# Altium schematic sheet FLASH.SchDoc
size A; SheetNumber: 4; SheetTotal: 4
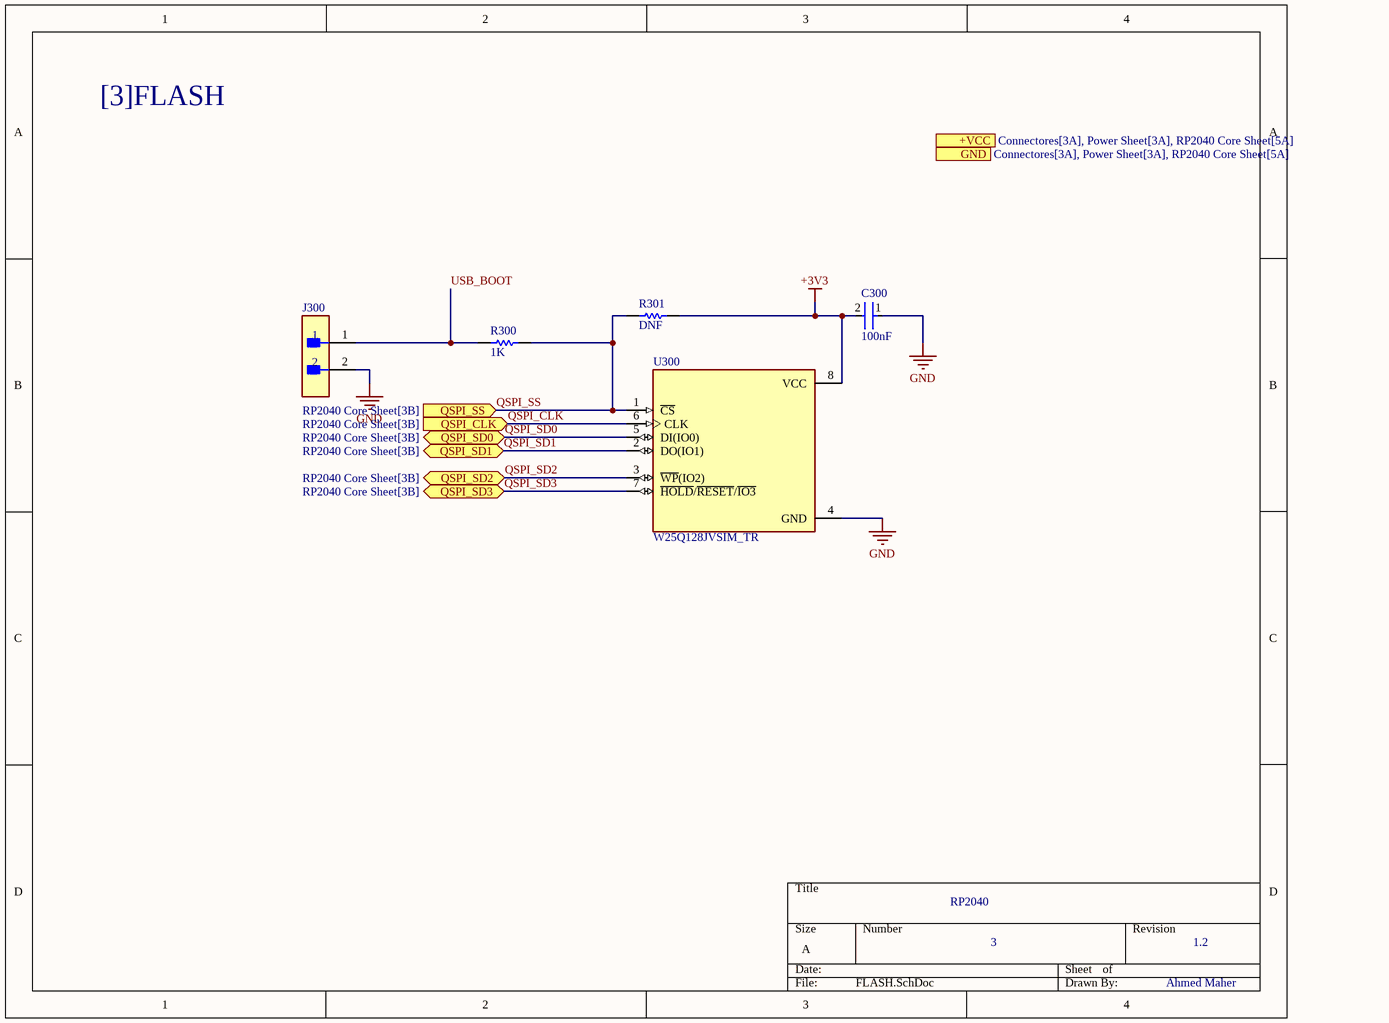
[diagram p0: FLASH.SchDoc]

## Parts
C300  100nF  [FP-CGA3E-0_3-0_1-IPC_A]
J300  M20-9990245  [FP-M20-9990245-MFG]  (value not drawn)
R300  1K  [RESC2013X60X35ML10T20]
R301  DNF  [RESC2013X60X35ML10T20]
U300  W25Q128JVSIM_TR  [SOIC127P790X216-8N]

## Ports
+VCC (see Connectores[3A], Power Sheet[3A], RP2040 Core Sheet[5A]), GND (see Connectores[3A], Power Sheet[3A], RP2040 Core Sheet[5A]), QSPI_CLK (in, see RP2040 Core Sheet[3B]), QSPI_SD0 (bidir, see RP2040 Core Sheet[3B]), QSPI_SD1 (bidir, see RP2040 Core Sheet[3B]), QSPI_SD2 (bidir, see RP2040 Core Sheet[3B]), QSPI_SD3 (bidir, see RP2040 Core Sheet[3B]), QSPI_SS (in, see RP2040 Core Sheet[3B])

## Nets
+3V3: C300.2 R301.2 U300.8(VCC)
GND: C300.1 J300.2 U300.4(GND)
QSPI_CLK: U300.6(CLK) ; port QSPI_CLK
QSPI_SD0: U300.5(DI(IO0)) ; port QSPI_SD0
QSPI_SD1: U300.2(DO(IO1)) ; port QSPI_SD1
QSPI_SD2: U300.3(~{WP}(IO2)) ; port QSPI_SD2
QSPI_SD3: U300.7(~{HOLD}/~{RESET}/~{IO3}) ; port QSPI_SD3
QSPI_SS: R300.2 R301.1 U300.1(~{CS}) ; port QSPI_SS
USB_BOOT: J300.1 R300.1

## Notes on the sheet
- [3]FLASH
- RP2040
- 3
- 1.2
- Ahmed Maher

## Library data of the parts
C300 = CMP-2000-07546-2: Cap Ceramic 100nF 50V X7R 10% Pad SMD 0603 +125°C Automotive T/R; Weight: 7.1E-05oz; Composition: Ceramic; Max Operating Temperature: 125°C; Termination: SMD/SMT; Dielectric: X7R; Length: 1.6mm; Package Quantity: 1; REACH SVHC: No SVHC; Lead Free: Lead Free; Case Code (Metric): 1608; Min Operating Temperature: -55°C; Packaging: Tape and Reel; Tolerance: 10%; Voltage Rating: 50V; Case Code (Imperial): 0603; Capacitance: 100nF; Case/Package: 0603; Voltage Rating (DC): 50V; Depth: 0.8mm; Radiation Hardening: No; Ratings: AEC-Q200; Mount: Surface Mount; Voltage: 50V; Thickness: 0.035inch; Width: 0.8mm; Height: 0.8mm
J300 = CMP-15831-000105-1: CONN HEADER VERT 2POS 2.54MM; Working Voltage: 750V; Gender: Male; Number of Poles: 2; Current Rating: 3A; Mated Stacking Heights: 16.54mm; Contact Resistance: 25mR; Connector Type: Male Pin; Insulation Resistance: 10GR; Mating Cycles: 300; Voltage: 50V; Flammability Rating: UL94 V-0; Pitch: 2.54mm; Series: M20; Number of Contacts: 2; Height: 0.12inch; Min Operating Temperature: -40°C; Contact Finish - Mating: GOLD; Number of Positions: 2; Number of Rows: 1; Packaging: Bulk; Package Quantity: 1000; Voltage Rating (AC): 750V; Current: 3A; Mount: Through Hole; Case/Package: SIL; Orientation: Straight; Contact Shape: Square; Weight: 0.25lb; Radiation Hardening: No; Fastening Type: Pull; Length: 5.08mm; Depth: 2.54mm; Contact Mating Length: 0.24inch; Housing Material: Nylon; Reach SVHC Compliant: Yes; Insulation Material: Nylon; Color: Black; Width: 0.25inch; Insulation Color: Black; Contact Material: Brass; Contact Type: Male Pin; Termination: Solder; Max Operating Temperature: 105°C; Contact Plating: Gold; Housing Color: Black; Max Current Rating: 3A; Lead Pitch: 2.54mm
R300 R301 = CMP-2100-03671-1: Chip Resistor, 1 KOhm, +/- 1%, 125 mW, -55 to 155 degC, 0805 (2012 Metric), RoHS, Tape and Reel; Manufacturer: Yageo; Temperature Coefficient: 100ppm/degreesC; Voltage Rating (DC): 150V; Max Power Dissipation: 125mW; Resistance: 1KOhm; Number of Pins: 2; Number of Terminations: 2; Datasheet URL: http://www.yageo.com/NewPortal/yageodocoutput?fileName=/pdf/R-Chip/PYu-RC_Group_51_RoHS_L_5.pdf; Length: 0.079inch; Package Description: 2-Pin Surface Mounted Device, Body 2 x 1.25 mm; Depth: 1.25mm; Height: 0.024inch; Military Standard: Not; Case/Package: 0805; Package Reference: 0805; RoHSCompliant: true; Lead Free: LeadFree; Packaging: TapeandReel; Package Quantity: 1; Datasheet Version: Rev. 5, 10/2016; Tolerance: 1%; Min Operating Temperature: -55degC; Voltage Rating: 150V; Composition: ThickFilm; Case Code (Imperial): 0805; Power Rating: 125mW; Width: 0.049inch; Case Code (Metric): 2012; Manufacturer URL: http://www.yageo.com/; Max Operating Temperature: 155degC; REACH SVHC: Unknown; Termination: SMD/SMT
U300 = W25Q128JVSIM_TR: FLASH - NOR Memory IC 128Mb (16M x 8) SPI - Quad I/O, QPI, DTR 133 MHz 8-SOIC; MF: Winbond Electronics; MP: W25Q128JVSIM TR; SnapEDA_Link: https://www.snapeda.com/parts/W25Q128JVSIM%20TR/Winbond/view-part/?ref=snap; Package: SOIC-8 Winbond Electronics; Value: *; Check_prices: https://www.snapeda.com/parts/W25Q128JVSIM%20TR/Winbond/view-part/?ref=eda